# EAGLE design KAMERA_ARAYUZ_STM32L4 (EAGLE 8.5.1)
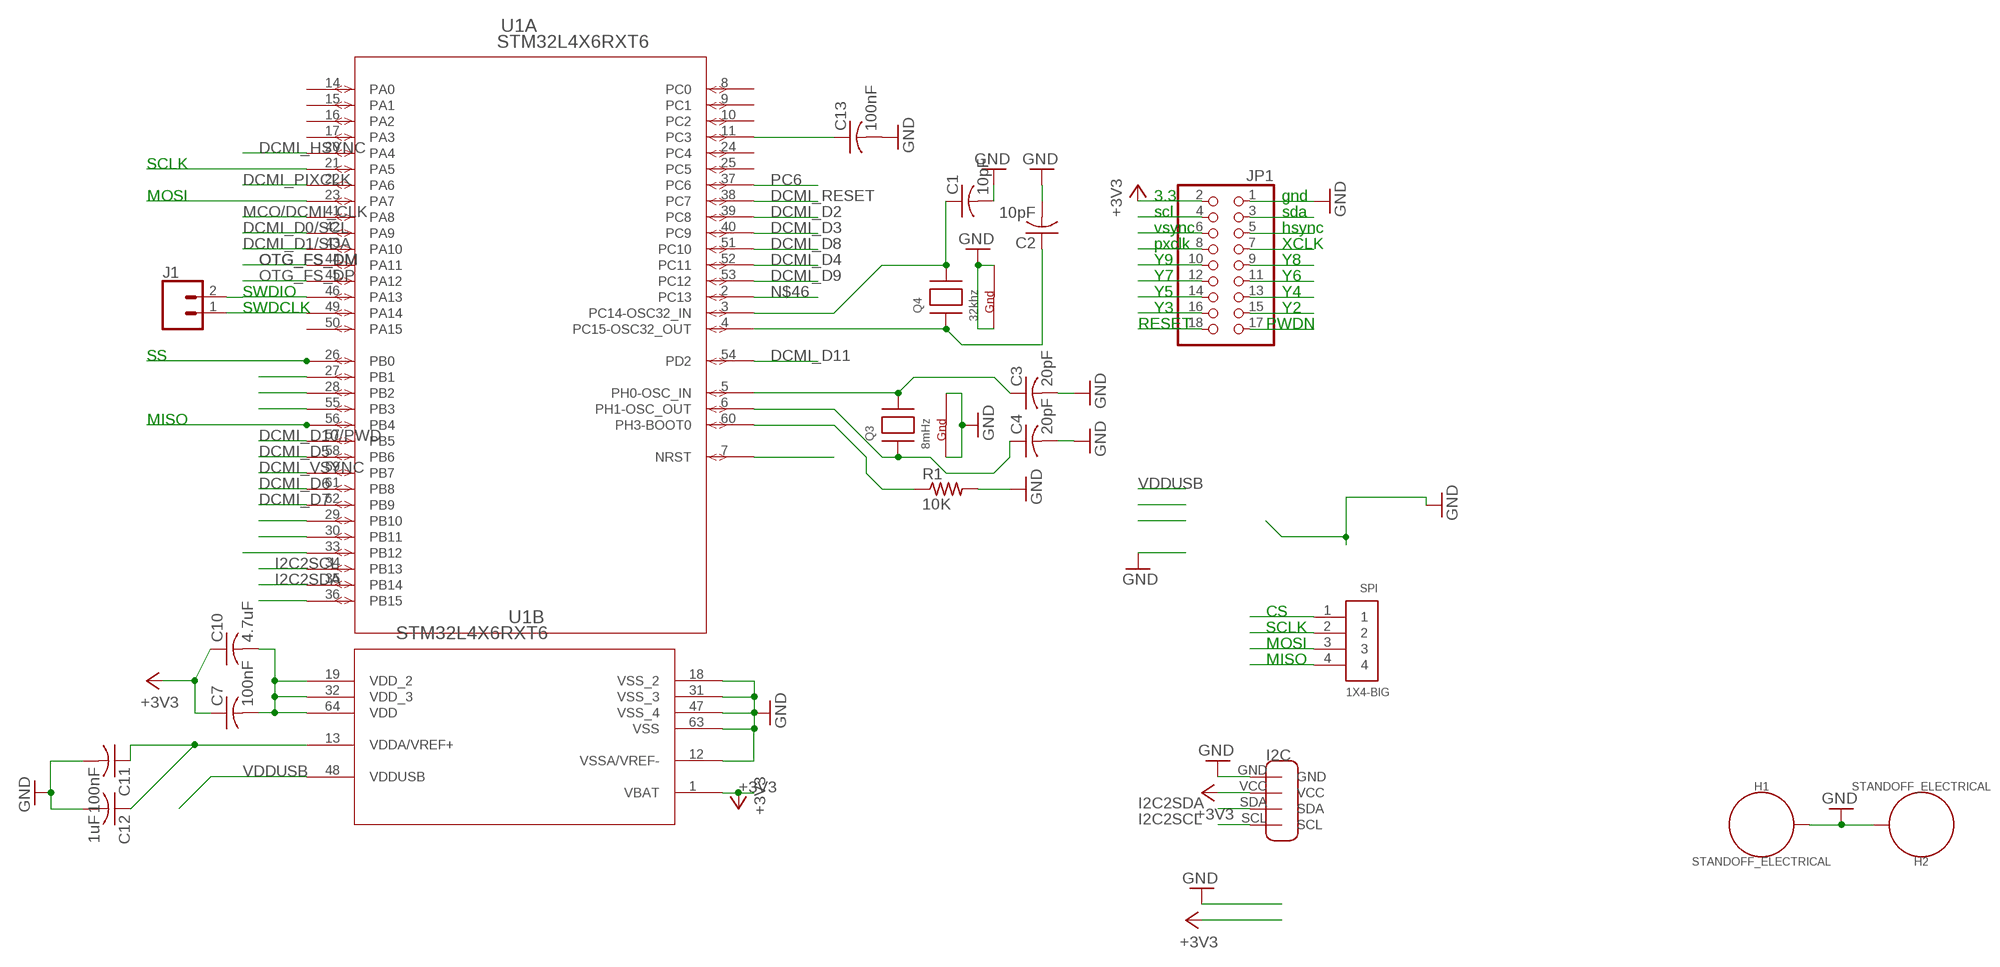
[diagram p0: schematic, sheet 1]

## Parts
C1  10pF  C-USC0805  [C0805]
C2  10pF  C-USC0805  [C0805]
C3  20pF  C-USC0805  [C0805]
C4  20pF  C-USC0805  [C0805]
C7  100nF  C-USC0805  [C0805]
C10  4.7uF  C-USC0805  [C0805]
C11  100nF  C-USC0805  [C0805]
C12  1uF  C-USC0805  [C0805]
C13  100nF  C-USC0805  [C0805]
H1  STANDOFF_ELECTRICAL  [STANDOFF-ELECTRICAL]
H2  STANDOFF_ELECTRICAL  [STANDOFF-ELECTRICAL]
J1  CONN_02  [1X02]
JP1  PINHD-2X9-CBIG  [2X09-CLEANBIG]
Q3  8mHz  XTAL-4-3225  [NX3225]
Q4  32khz  XTAL-4-3225  [NX3225]
R1  10K  R-US_R0805  [R0805]
SPI  1X4-BIG  [1X04-BIG]
U1  STM32L4X6RXT6  [LQFP64-10X10MM]
U$2  I2C  [I2C]

## Nets
+3V3: C7.1 C10.1 JP1.2 U1.1(B:VBAT) U$2.VCC
CS: SPI.1 U1.26(A:PB0)
DCMI_D0/SCL: JP1.4 U1.42(A:PA9)
DCMI_D1/SDA: JP1.3 U1.43(A:PA10)
DCMI_D2: JP1.15 U1.39(A:PC8)
DCMI_D3: JP1.16 U1.40(A:PC9)
DCMI_D4: JP1.13 U1.52(A:PC11)
DCMI_D5: JP1.14 U1.58(A:PB6)
DCMI_D6: JP1.11 U1.61(A:PB8)
DCMI_D7: JP1.12 U1.62(A:PB9)
DCMI_D8: JP1.9 U1.51(A:PC10)
DCMI_D9: JP1.10 U1.53(A:PC12)
DCMI_D10/PWD: JP1.17 U1.57(A:PB5)
DCMI_D11: U1.54(A:PD2)
DCMI_HSYNC: JP1.5 U1.20(A:PA4)
DCMI_PIXCLK: JP1.8 U1.22(A:PA6)
DCMI_RESET: JP1.18 U1.38(A:PC7)
DCMI_VSYNC: JP1.6 U1.59(A:PB7)
GND: C1.2 C2.2 C3.2 C4.2 C11.2 C12.2 C13.2 H1.P1 H2.P1 JP1.1 Q3.2(G2) Q3.4(G1) Q4.2(G2) Q4.4(G1) R1.2 U1.12(B:VSSA/VREF-) U1.18(B:VSS_2) U1.31(B:VSS_3) U1.47(B:VSS_4) U1.63(B:VSS) U$2.GND
I2C2SCL: U1.34(A:PB13) U$2.SCL
I2C2SDA: U1.35(A:PB14) U$2.SDA
MCO/DCMI_CLK: JP1.7 U1.41(A:PA8)
MISO: SPI.4 U1.56(A:PB4)
MOSI: SPI.3 U1.23(A:PA7)
N$1: C2.1 Q4.1(X1) U1.4(A:PC15-OSC32_OUT)
N$4: C3.1 Q3.3(X2) U1.5(A:PH0-OSC_IN)
N$19: C4.1 Q3.1(X1) U1.6(A:PH1-OSC_OUT)
N$25: R1.1 U1.60(A:PH3-BOOT0)
N$27: C11.1 C12.1 U1.13(B:VDDA/VREF+)
N$28: C13.1 U1.11(A:PC3)
N$30: C7.2 C10.2 U1.19(B:VDD_2) U1.32(B:VDD_3) U1.64(B:VDD)
N$33: U1.27(A:PB1)
N$34: C1.1 Q4.3(X2) U1.3(A:PC14-OSC32_IN)
N$35: U1.28(A:PB2)
N$38: U1.55(A:PB3)
N$46: U1.2(A:PC13)
N$52: U1.7(A:NRST)
N$55: U1.29(A:PB10)
N$56: U1.30(A:PB11)
N$57: U1.33(A:PB12)
N$60: U1.36(A:PB15)
OTG_FS_DM: U1.44(A:PA11)
OTG_FS_DP: U1.45(A:PA12)
PC6: U1.37(A:PC6)
SCLK: SPI.2 U1.21(A:PA5)
SWDCLK: J1.1 U1.49(A:PA14)
SWDIO: J1.2 U1.46(A:PA13)
VDDUSB: U1.48(B:VDDUSB)
Unconnected: U1.8(A:PC0) U1.9(A:PC1) U1.10(A:PC2) U1.14(A:PA0) U1.15(A:PA1) U1.16(A:PA2) U1.17(A:PA3) U1.24(A:PC4) U1.25(A:PC5) U1.50(A:PA15)

## Notes on the sheet
- SCLK
- MOSI | 3.3 | gnd
- scl | sda
- vsync | hsync
- pxclk | XCLK
- Y9 | Y8
- Y7 | Y6
- SWDIO | Y5 | Y4
- SWDCLK | Y3 | Y2
- RESET | PWDN
- SS
- MISO
- CS
- SCLK
- MOSI
- MISO

## Library data of the parts
C1-C4 C7 C10-C13 = adafruit:C-US: CAPACITOR, American symbol
H1 H2 = SparkFun-Hardware:STANDOFF_ELECTRICAL: Stand Off Drill holes with an electrical connection. For example, use these to ground your board to a chassis. Example SparkFun Products Screw - Phillips Head (1/4", 4-40, 10 pack) <https://www.sparkfun.com/products/10453> (PRT-10453) Screw - Phillips Head (1/2", 4-40, 10 pack) <https://www.sparkfun.com/products/10452> (PRT-10452) Screw - Phillips Head (3/4", 4-40, 10 pack) <https://www.sparkfun.com/products/10451> (PRT-10451) Screw - Phillips Head (1", 4-40, 10 pack) <https://www.sparkfun.com/products/10450> (PRT-10450)
J1 = SparkFun-Connectors:CONN_02: Multi connection point. Often used as Generic Header-pin footprint for 0.1 inch spaced/style header connections On any of the 0.1 inch spaced packages, you can populate with these: Break Away Headers - Straight <https://www.sparkfun.com/products/116> (PRT-00116) Break Away Male Headers - Right Angle <https://www.sparkfun.com/products/553> (PRT-00553) Female Headers <https://www.sparkfun.com/products/115> (PRT-00115) Break Away Headers - Machine Pin <https://www.sparkfun.com/products/117> (PRT-00117) Break Away Female Headers - Swiss Machine Pin <https://www.sparkfun.com/products/743> (PRT-00743) For SCREWTERMINALS and SPRING TERMINALS visit here: Screw Terimnals on SparkFun.com <https://www.sparkfun.com/search/results?term=Screw+Terminals> (5mm/3.5mm/2.54mm spacing) This device is also useful as a general connection point to wire up your design to another part of your project. Our various solder wires solder well into these plated through hole pads. Hook-Up Wire - Assortment (Stranded, 22 AWG) <https://www.sparkfun.com/products/11375> (PRT-11375) Hook-Up Wire - Assortment (Solid Core, 22 AWG) <https://www.sparkfun.com/products/11367> (PRT-11367) View the entire wire category on our website here <https://www.sparkfun.com/categories/141> Special notes: Molex polarized connector foot print use with: PRT-08233 with associated crimp pins and housings. 2.54_SCREWTERM for use with PRT-10571. 3.5mm Screw Terminal footprints for PRT-08084 5mm Screw Terminal footprints for use with PRT-08432
JP1 = adafruit:PINHD-2X9: PIN HEADER With larger annulars
Q3 Q4 = adafruit:XTAL-4: Classic 4-pin 3.2 x 2.5mm crystal
R1 = adafruit:R-US_: RESISTOR, American symbol
SPI = adafruit:1X4: 4-pin connector
U1 = stm32l4+(pll64):STM32L4X6RXT6; COPYRIGHT: Copyright C 2016 Accelerated Designs. All rights reserved; MANUFACTURER_PART_NUMBER: stm32l4x6rxt6; VENDOR: STMicroelectronics
U$2 = 0000000111111aaa:I2C

## Board
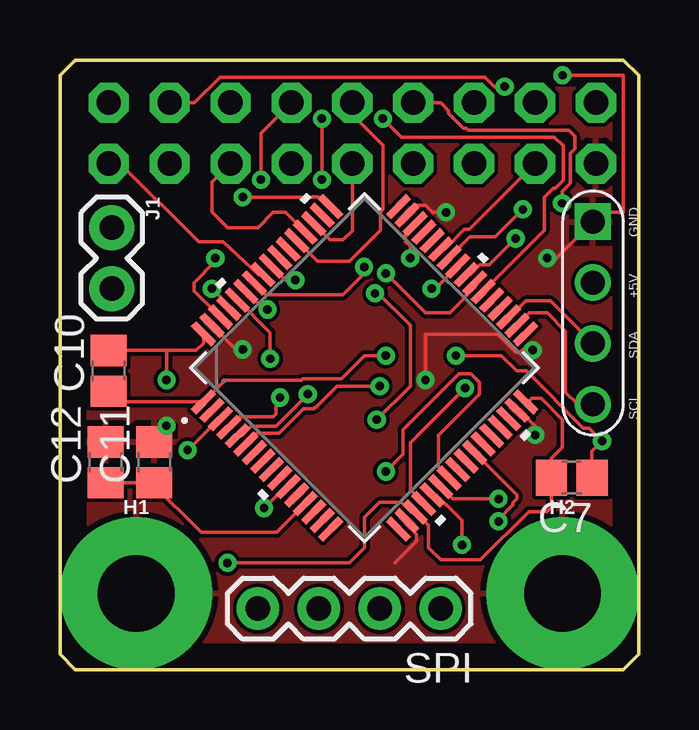
[diagram p1: board, top side]
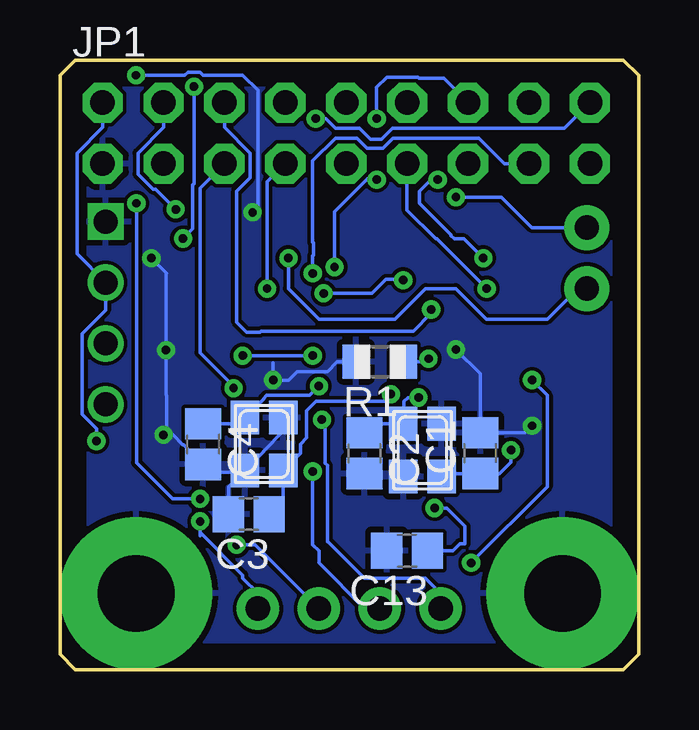
[diagram p2: board, bottom side, seen from below]

Size 24.13 x 25.4 mm. Coordinates in mm from the lower left corner, seen from the top.
Outline: 0.64,25.4 23.5,25.4 24.13,24.77 24.13,0.63 23.5,0 0.64,0 0,0.63 0,24.77 0.64,25.4
Copper layers (1*16): Top 0.035mm / dielectric 1.5mm / Bottom 0.035mm
Design rules "default": minimum track width 6mil, minimum drill 0.35mm, track to track 6mil, track to pad 6mil, pad to pad 6mil, via to via 6mil, smd to smd 6mil, copper to edge 40mil, drill to drill 6mil, minimum pad ring 10mil, minimum via ring 8mil, stop-mask expansion 4mil, vias tented up to drill 0mil, thermal gap 10mil

### Footprints (pad centres in the part's own frame; a part is rotated, then mirrored left to right if it is on the bottom)
C0805 = smd 1.3 x 1.5: 1 -0.85,0; 2 0.85,0
STANDOFF-ELECTRICAL = drill 3.2 pad 6.35: P1 0,0
1X02 = drill 1.016 pad 1.88: 1 0,0; 2 2.54,0
2X09-CLEANBIG = drill 1.016 pad 1.676 octagon: 1 -10.16,-1.27; 2 -10.16,1.27; 3 -7.62,-1.27; 4 -7.62,1.27; 5 -5.08,-1.27; 6 -5.08,1.27; 7 -2.54,-1.27; 8 -2.54,1.27; 9 0,-1.27; 10 0,1.27; 11 2.54,-1.27; 12 2.54,1.27; 13 5.08,-1.27; 14 5.08,1.27; 15 7.62,-1.27; 16 7.62,1.27; 17 10.16,-1.27; 18 10.16,1.27
NX3225 = smd 1.4 x 1.2: 1 -1.1,-0.8; 2 1.1,-0.8; 3 1.1,0.8; 4 -1.1,0.8
R0805 = smd 1.1 x 1.4: 1 -1,0; 2 1,0
1X04-BIG = drill 1.016 pad 1.778: 1 0,0; 2 2.54,0; 3 5.08,0; 4 7.62,0
LQFP64-10X10MM = smd 1.194 x 0.305: 1 -5.75,3.75; 2 -5.75,3.25; 3 -5.75,2.75; 4 -5.75,2.25; 5 -5.75,1.75; 6 -5.75,1.25; 7 -5.75,0.75; 8 -5.75,0.25; 9 -5.75,-0.25; 10 -5.75,-0.75; 11 -5.75,-1.25; 12 -5.75,-1.75; 13 -5.75,-2.25; 14 -5.75,-2.75; 15 -5.75,-3.25; 16 -5.75,-3.75; 33 5.75,-3.75; 34 5.75,-3.25; 35 5.75,-2.75; 36 5.75,-2.25; 37 5.75,-1.75; 38 5.75,-1.25; 39 5.75,-0.75; 40 5.75,-0.25; 41 5.75,0.25; 42 5.75,0.75; 43 5.75,1.25; 44 5.75,1.75; 45 5.75,2.25; 46 5.75,2.75; 47 5.75,3.25; 48 5.75,3.75 | smd 0.305 x 1.194: 17 -3.75,-5.75; 18 -3.25,-5.75; 19 -2.75,-5.75; 20 -2.25,-5.75; 21 -1.75,-5.75; 22 -1.25,-5.75; 23 -0.75,-5.75; 24 -0.25,-5.75; 25 0.25,-5.75; 26 0.75,-5.75; 27 1.25,-5.75; 28 1.75,-5.75; 29 2.25,-5.75; 30 2.75,-5.75; 31 3.25,-5.75; 32 3.75,-5.75; 49 3.75,5.75; 50 3.25,5.75; 51 2.75,5.75; 52 2.25,5.75; 53 1.75,5.75; 54 1.25,5.75; 55 0.75,5.75; 56 0.25,5.75; 57 -0.25,5.75; 58 -0.75,5.75; 59 -1.25,5.75; 60 -1.75,5.75; 61 -2.25,5.75; 62 -2.75,5.75; 63 -3.25,5.75; 64 -3.75,5.75
I2C = drill 1 square: GND -2.54,0 | drill 1: SCL 5.08,0; SDA 2.54,0; VCC 0,0

### Placement (x,y rotation side)
C1  6.6,9.02 90 bottom
C2  11.43,9.02 270 bottom
C3  16.26,6.48 180 bottom
C4  18.16,9.4 270 bottom
C7  21.34,8 180 top
C10  2.03,12.45 90 top
C11  3.94,8.64 90 top
C12  1.91,8.64 90 top
C13  9.65,4.95 180 bottom
H1  3.18,3.17 0 top
H2  20.95,3.17 0 top
J1  2.16,18.41 270 top
JP1  12.19,22.35 0 bottom
Q3  15.62,9.4 270 bottom
Q4  9.02,9.14 270 bottom
R1  10.8,12.83 180 bottom
SPI  15.88,2.54 180 top
U1  12.7,12.57 45 top
U$2  22.23,16.13 270 top

### Tracks (layer width: path | path; a pad name or v marks a point on that pad's centre or on a via)
+3V3  (via drill 0.35)
  Top 0.152: C7.1 22.19,9.1 v22.61,9.52 22.06,10.07 21.82,10.07 19.44,12.45 19.05,12.45 18.41,13.08 v16.51,13.08 | v13.59,13.08 12.7,13.08 11.73,12.12 10.12,12.12 10.06,12.06 6.89,12.06 U1.1 2.47,11.16 C10.1
  Bottom 0.152: JP1.2 22.35,22.59 23.42,21.52 23.42,17.32 U$2.VCC 22.23,14.98 23.21,14 23.21,10.64 22.61,10.04 v22.61,9.52 | v13.59,13.08 v16.51,13.08
CS  (via drill 0.35)
  Top 0.152: 17.46,9.04 U1.26 19.05,7.28 19.05,7.11 18.9,6.96 18.9,6.86 18.29,6.25 v18.29,6.18
  Bottom 0.152: v18.29,6.18 18.29,5.71 | 18.29,5.71 18.29,5.59 | 18.29,5.71 16.51,3.94 16.51,3.81 15.88,3.17 SPI.1
DCMI_D0/SCL  (via drill 0.35)
  Top 0.152: v19.3,19.18 18.16,18.03 17.1,18.03 U1.42
  Bottom 0.152: JP1.4 19.81,22.59 20.88,21.52 20.88,20.64 20.25,20.02 20.14,20.02 v19.3,19.18
DCMI_D1/SDA
  Top 0.152: JP1.3 17.07,18.34 16.87,18.34 16.05,17.52 U1.43
DCMI_D2  (via drill 0.35)
  Top 0.152: v13.59,16.51 15.24,14.86 16.26,14.86 16.89,15.49 16.89,15.53 17.3,15.94 U1.39
  Bottom 0.152: JP1.15 5.6,21.08 6.67,22.15 10.24,22.15 10.67,21.72 11.32,21.72 11.75,22.15 12.63,22.15 13.59,21.19 13.59,17.8 13.56,17.78 13.56,17.27 13.59,17.25 v13.59,16.51
DCMI_D3  (via drill 0.35)
  Top 0.152: JP1.16 5.6,23.62 6.67,24.69 17.71,24.69 18.12,24.29 v18.54,24.29 | U1.40 17.11,16.46 17.52,16.87 17.9,16.87 v19,17.96
  Bottom 0.152: v18.54,24.29 18.54,20.24 18.59,20.19 18.59,18.36 v19,17.96
DCMI_D4
  Top 0.152: U1.52 9.41,19.05 8.89,19.05 8.26,18.41 6.98,18.41 6.35,19.05 6.35,20.32 JP1.13
DCMI_D5  (via drill 0.35)
  Top 0.152: U1.58 8.59,15.62 11.81,15.62 12.83,16.64 v12.69,16.77 v12.68,16.77 | v10.92,20.42 v10.92,22.96
  Bottom 0.152: v12.68,16.77 12.68,19.07 11.3,20.45 10.92,20.45 10.8,20.57 | 10.8,20.57 10.8,20.7 | 10.8,20.57 10.8,20.54 v10.92,20.42 | v10.92,22.96 10.92,24.26 10.49,24.69 9.21,24.69 9.16,24.64 8.13,24.64 JP1.14
DCMI_D6  (via drill 0.35)
  Top 0.152: U1.61 7.04,15.17 v6.34,15.88
  Bottom 0.152: v6.34,15.88 8.41,17.94 8.45,17.94 9.65,19.14 JP1.11
DCMI_D7  (via drill 0.35)
  Top 0.152: U1.62 6.12,15.27 6.09,15.27 5.59,15.77 5.59,16.13 6.48,17.02 v6.48,17.15 | v8.38,20.42 8.38,22.35 JP1.12
  Bottom 0.152: v6.48,17.15 7.28,17.94 7.69,17.94 7.83,18.08 7.83,18.11 9.14,19.43 9.14,19.94 8.67,20.42 v8.38,20.42
DCMI_D8
  Top 0.152: U1.51 11.26,17.91 11.81,17.91 12.19,18.29 JP1.9
DCMI_D9
  Top 0.152: U1.53 10.73,17.02 12.07,17.02 13.36,18.31 13.36,19.07 13.46,19.18 13.46,21.84 12.19,23.11 JP1.10
DCMI_D10/PWD
  Top 0.152: U1.57 8.29,16.46 6.81,17.82 5.97,17.82 5.77,17.82 2.51,21.08 JP1.17 2.79,21.08
DCMI_HSYNC  (via drill 0.35)
  Top 0.152: v16.89,11.73 14.61,9.44 14.61,7.49 U1.20
  Bottom 0.152: JP1.5 18.29,20.07 18.29,13.21 16.89,11.81 v16.89,11.73
DCMI_PIXCLK  (via drill 0.35)
  Top 0.152: v20.94,19.43 20.94,19.92 21.28,20.27 21.28,21.52 21.46,21.7 21.46,22.23 21.21,22.48 17.02,22.48 16.94,22.55 16.83,22.55 16.21,23.18 16.21,23.29 15.88,23.62 JP1.8 | U1.22 16.39,7.11 v18.29,7.11
  Bottom 0.152: v20.94,19.43 20.94,8.62 19.43,7.11 v18.29,7.11
DCMI_RESET  (via drill 0.35)
  Top 0.152: v13.46,22.96 14.24,22.17 20.62,22.17 20.98,21.82 20.98,20.4 20.65,20.07 20.57,20.07 20.19,19.69 20.19,18.3 U1.38
  Bottom 0.152: v13.46,22.96 13.04,22.96 12.63,22.55 11.63,22.55 11.18,22.1 10.72,22.1 10.26,22.55 3.1,22.55 JP1.18
DCMI_VSYNC  (via drill 0.35)
  Top 0.152: v8.65,15 8.5,15 U1.59
  Bottom 0.152: JP1.6 17.27,22.59 16.21,21.52 16.21,20.5 16.76,19.94 16.76,14.48 16.35,14.06 15.79,14.06 15.75,14.1 9.4,14.1 8.65,14.84 v8.65,15
GND  (via drill 0.35)
  Top 0.152: v19.81,9.78 19.81,10.16 19.17,10.8 U1.31 | v15.24,12.06 15.24,13.97 18.27,13.97 19.01,13.23 19.2,13.23 | 19.2,13.23 19.58,13.23 19.69,13.34 | 19.2,13.23 19.28,13.31 v19.71,13.31 | v20.95,24.77 23.5,24.77 23.5,19.05 22.61,19.05 U$2.GND 20.7,17.15 v20.32,17.15 | U1.63 7.34,13.34 v7.62,13.34 | U1.18 14.47,6.04 14.87,5.64 14.87,5.35 13.97,4.45 | v16.1,19.05 15.52,19.05 15.23,19.34 14.87,19.34 U1.47 | v4.45,10.16 3.94,9.65 C11.2
  Bottom 0.152: C3.2 17.11,7.61 16.49,8.23 | 16.49,8.23 Q3.2 15.65,9.07 15.65,9.09 14.82,9.92 Q3.4 | 16.49,8.23 17.84,8.23 C4.2 18.98,9.37 19.01,9.37 19.41,9.78 v19.81,9.78 19.69,9.91 19.69,11.43 19.71,11.45 v19.71,13.31 19.71,16.49 19.69,16.51 v20.32,17.15 | R1.2 12.57,12.83 12.98,12.42 14.25,12.42 14.61,12.06 v15.24,12.06 15.24,12.78 | v20.95,24.77 18.92,24.77 18.79,24.9 18.29,24.9 18.16,24.77 16.51,24.77 15.88,24.13 15.88,19.05 v16.1,19.05 | v7.62,13.34 6.6,12.32 C1.2 4.74,9.87 v4.45,10.16
  pour Bottom: 0,24.77 0.64,25.4 23.5,25.4 24.13,24.77 24.13,0.63 23.5,0 0.64,0 0,0.63
  pour Top: 0,3.17 0,24.77 0.64,25.4 23.5,25.4 24.13,24.77 24.13,0.63 23.5,0 0.64,0 0,0.63
I2C2SCL
  Top 0.152: U1.34 19.58,14.86 20.32,14.86 21.08,14.1 21.08,11.56 21.59,11.05 U$2.SCL
I2C2SDA
  Top 0.152: U$2.SDA 20.45,15.37 19.43,15.37 18.76,14.69 U1.35
MCO/DCMI_CLK  (via drill 0.35)
  Top 0.152: U1.41 15.65,15.88 v15.49,15.88
  Bottom 0.152: v15.49,15.88 15.49,20.32 JP1.7
MISO  (via drill 0.35)
  Top 0.152: v13.21,10.41 14.61,11.81 14.61,14.35 13.21,15.75 v13.14,15.68 | v9.82,16.23 9.4,16.23 U1.56
  Bottom 0.152: v13.21,10.41 13.08,10.29 13.08,8.6 12.98,8.51 12.98,5.34 12.96,5.34 11.43,3.81 8.89,3.81 8.26,3.17 SPI.4 | v13.14,15.68 11.12,15.68 10.54,16.26 9.85,16.26 v9.82,16.23
MOSI  (via drill 0.35)
  Top 0.152: v13.59,8.26 14.3,8.97 14.3,10 16.64,12.34 17.14,12.34 17.5,11.98 17.5,11.48 15.79,9.77 15.79,8.42 U1.23
  Bottom 0.152: v13.59,8.26 13.59,5.21 13.34,4.95 13.34,4.45 11.43,2.54 SPI.3
N$1  (via drill 0.35)
  Top 0.152: v9.18,11.34 9.02,11.18 9.02,10.67 8.89,10.54 7.49,10.54 U1.4
  Bottom 0.152: C2.1 11.05,10.24 Q4.1 9.78,10.28 9.78,11.18 9.62,11.34 v9.18,11.34
N$4  (via drill 0.35)
  Top 0.152: U1.5 7.57,9.74 7.97,10.15 9.01,10.15 v10.34,11.48
  Bottom 0.152: C3.1 14.82,7.06 Q3.3 14.1,9.02 14.1,9.4 13.84,9.65 13.84,10.8 13.46,11.18 10.29,11.18 10.29,11.43 v10.34,11.48
N$19  (via drill 0.35)
  Top 0.152: U1.6 8.2,9.84 9.13,9.84 9.3,10.01 | 9.3,10.01 | 9.3,10.01 10.16,10.87 10.59,10.87 10.64,10.92 10.67,10.92 11.56,11.81 v13.34,11.81
  Bottom 0.152: C4.1 16.67,10.25 Q3.1 15.65,11.27 15.65,11.29 15.52,11.43 15.24,11.43 13.72,11.43 v13.34,11.81
N$25  (via drill 0.35)
  Top 0.152: U1.60 8.76,14.03 v8.76,12.95
  Bottom 0.152: v8.76,12.95 8.89,12.83 R1.1
N$27
  Top 0.152: C12.1 3.81,7.79 | 3.81,7.79 C11.1 | U1.13 9.02,5.71 5.88,5.71 3.81,7.79
N$28  (via drill 0.35)
  Top 0.152: U1.11 9.4,7.62 v8.51,6.73
  Bottom 0.152: v8.51,6.73 8,6.73 7.24,5.97 7.24,5.25 7.45,5.25 7.75,4.95 C13.1
N$30  (via drill 0.35)
  Top 0.152: C7.2 20.32,8.17 | U1.32 19.48,11.1 19.69,11.3 20.07,11.3 20.95,10.41 20.95,9.27 20.49,8.8 C7.2 | C7.2 20.49,6.77 20.3,6.58 19.55,6.58 17.54,4.57 15.88,4.57 15.37,5.08 15.37,6.02 U1.19 14.65,6.56 14.25,6.97 13.32,6.97 12.7,6.35 12.7,5.08 12.07,4.45 v6.98,4.45 | C10.2 4.45,13.3 | 4.45,13.3 5.68,13.3 5.98,13.6 U1.64 | 4.45,13.3 v4.45,12.06
  Bottom 0.152: v4.45,12.06 3.81,11.43 3.81,7.62 v6.98,4.45
N$34  (via drill 0.35)
  Top 0.152: v5.32,9.14 6.63,10.45 U1.3
  Bottom 0.152: Q4.3 8.09,8.17 C1.1 5.8,8.17 5.32,8.65 v5.32,9.14
SCLK  (via drill 0.35)
  Top 0.152: v16.76,5.2 16.76,6.22 16.12,6.87 16.1,6.87 15.7,7.27 U1.21
  Bottom 0.152: SPI.2 15.99,5.2 v16.76,5.2
SWDCLK  (via drill 0.35)
  Top 0.152: v7.62,19.69 10.51,19.69 10.52,19.7 10.71,19.7 10.72,19.69 10.89,19.69 U1.49
  Bottom 0.152: J1.1 4.45,18.41 5.72,19.69 v7.62,19.69
SWDIO  (via drill 0.35)
  Top 0.152: v14.61,17.15 14.61,17.63 14.42,17.82 14.42,18.18 U1.46
  Bottom 0.152: v14.61,17.15 14.61,15.88 13.34,14.6 10.16,14.6 8.89,15.88 7.62,15.88 6.35,14.6 3.81,14.6 2.54,15.88 J1.2